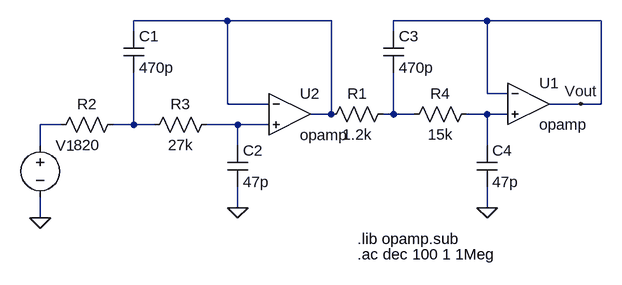
[diagram p0: schematic Tx filter.asc]
Tx filter.asc, the LTspice schematic file:
Version 4
SHEET 1 880 680
WIRE 112 96 -32 96
WIRE 272 96 112 96
WIRE 512 96 368 96
WIRE 688 96 512 96
WIRE -32 112 -32 96
WIRE 368 112 368 96
WIRE 512 208 512 96
WIRE 544 208 512 208
WIRE 112 224 112 96
WIRE 176 224 112 224
WIRE 656 224 608 224
WIRE 688 224 688 96
WIRE 688 224 656 224
WIRE 272 240 272 96
WIRE 272 240 240 240
WIRE 368 240 368 176
WIRE 368 240 352 240
WIRE 400 240 368 240
WIRE 512 240 480 240
WIRE 544 240 512 240
WIRE -144 256 -176 256
WIRE -32 256 -32 176
WIRE -32 256 -64 256
WIRE 0 256 -32 256
WIRE 128 256 80 256
WIRE 176 256 128 256
WIRE -176 288 -176 256
WIRE 128 288 128 256
WIRE 512 288 512 240
WIRE 128 384 128 352
WIRE 512 384 512 352
WIRE -176 400 -176 368
FLAG -176 400 0
FLAG 128 384 0
FLAG 512 384 0
FLAG 656 224 Vout
SYMBOL opamp 576 160 R0
SYMATTR InstName U1
SYMBOL opamp 208 176 R0
SYMATTR InstName U2
SYMBOL Res -48 240 R90
WINDOW 0 0 56 VBottom 2
WINDOW 3 32 56 VTop 2
SYMATTR InstName R2
SYMATTR Value 820
SYMBOL Res 96 240 R90
WINDOW 0 0 56 VBottom 2
WINDOW 3 32 56 VTop 2
SYMATTR InstName R3
SYMATTR Value 27k
SYMBOL Cap -48 112 R0
SYMATTR InstName C1
SYMATTR Value 470p
SYMBOL voltage -176 272 R0
SYMATTR InstName V1
SYMATTR Value ""
SYMATTR Value2 AC 1
SYMBOL Cap 112 288 R0
SYMATTR InstName C2
SYMATTR Value 47p
SYMBOL Res 368 224 R90
WINDOW 0 0 56 VBottom 2
WINDOW 3 32 56 VTop 2
SYMATTR InstName R1
SYMATTR Value 1.2k
SYMBOL Res 496 224 R90
WINDOW 0 0 56 VBottom 2
WINDOW 3 32 56 VTop 2
SYMATTR InstName R4
SYMATTR Value 15k
SYMBOL Cap 352 112 R0
SYMATTR InstName C3
SYMATTR Value 470p
SYMBOL Cap 496 288 R0
SYMATTR InstName C4
SYMATTR Value 47p
TEXT 312 432 Left 2 !.lib opamp.sub
TEXT 312 456 Left 2 !.ac dec 100 1 1Meg

The netlist it stands for:
* Tx filter.asc
XU1 Vout N003 Vout opamp Aol=100K GBW=10Meg  ; pins invin noninvin out
XU2 N001 N006 N001 opamp Aol=100K GBW=10Meg  ; pins invin noninvin out
R2 N005 N004 820
R3 N006 N005 27k
C1 N001 N005 470p
V1 N004 0 AC 1
C2 N006 0 47p
R1 N002 N001 1.2k
R4 N003 N002 15k
C3 Vout N002 470p
C4 N003 0 47p
.lib opamp.sub
.ac dec 100 1 1Meg
.backanno
.end